# Altium schematic sheet ANALOG_VOUTPUT.SchDoc
size A4; SheetNumber: 9; SheetTotal: 17
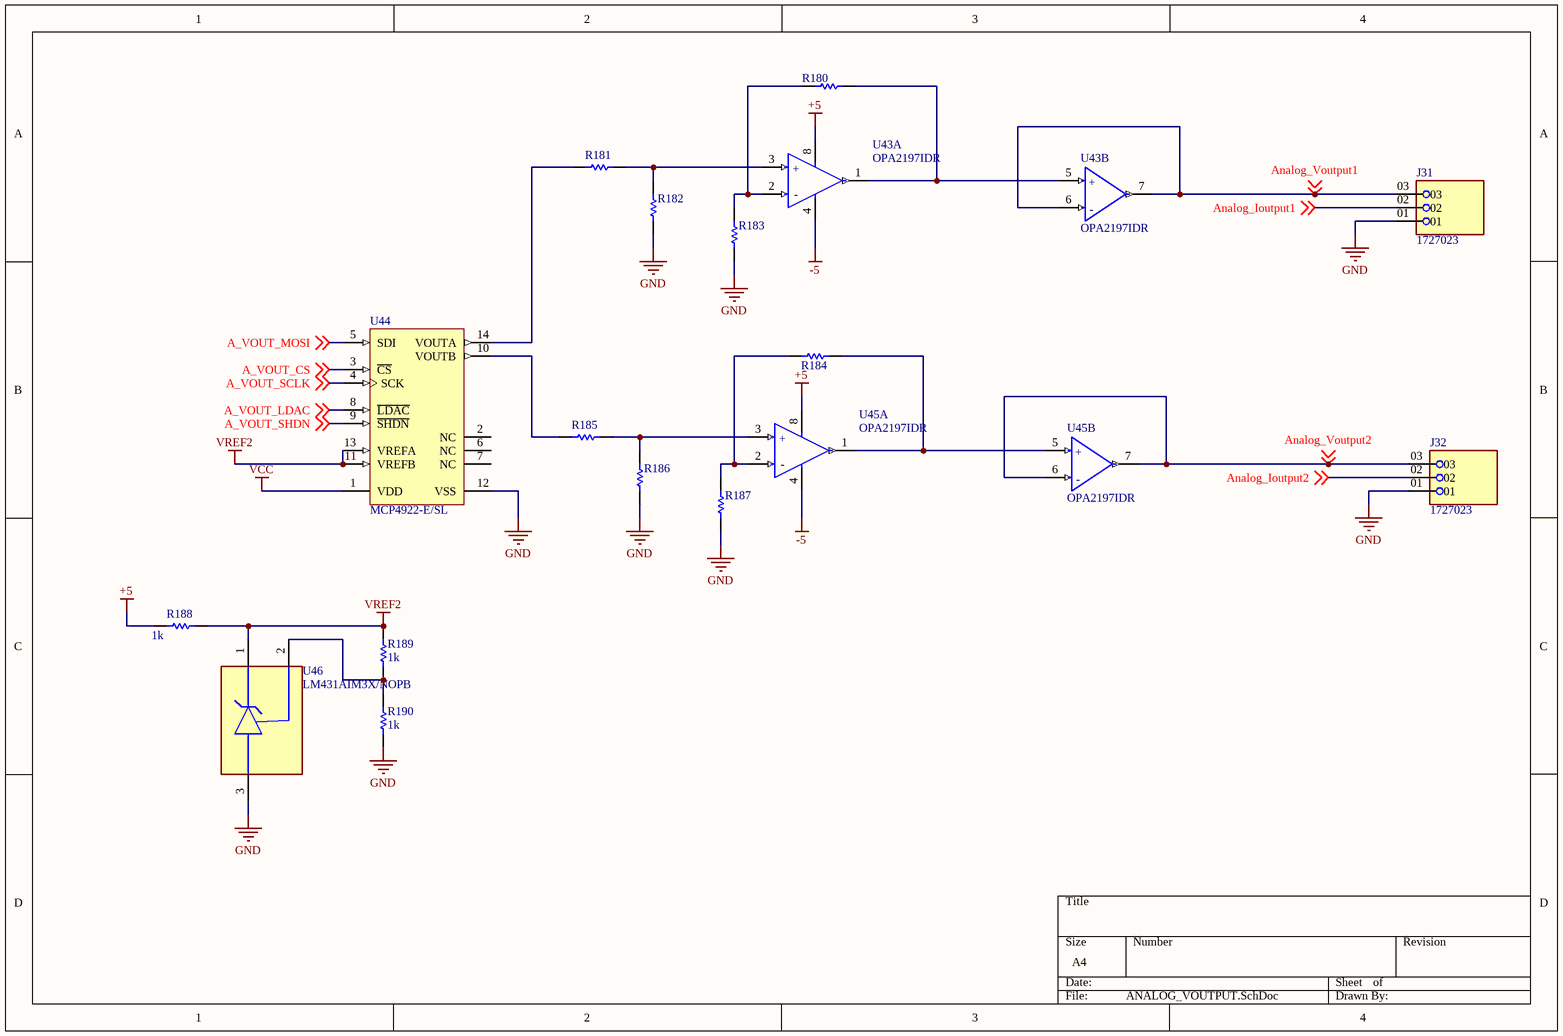
[diagram p0: ANALOG_VOUTPUT.SchDoc]

## Parts
J31  1727023  [PHOENIX_1727023]
J32  1727023  [PHOENIX_1727023]
R180  CRCW060310K0FKEA  [RESC1609X50X30NL8T20]  (value not drawn)
R181  CRCW060310K0FKEA  [RESC1609X50X30NL8T20]  (value not drawn)
R182  CRCW060310K0FKEA  [RESC1609X50X30NL8T20]  (value not drawn)
R183  CRCW060310K0FKEA  [RESC1609X50X30NL8T20]  (value not drawn)
R184  CRCW060310K0FKEA  [RESC1609X50X30NL8T20]  (value not drawn)
R185  CRCW060310K0FKEA  [RESC1609X50X30NL8T20]  (value not drawn)
R186  CRCW060310K0FKEA  [RESC1609X50X30NL8T20]  (value not drawn)
R187  CRCW060310K0FKEA  [RESC1609X50X30NL8T20]  (value not drawn)
R188  value 1k  [RESC2013X50X30NL20T20]  (hidden comment: CRCW08051K00FKTC)
R189  value 1k  [RESC2013X50X30NL20T20]  (hidden comment: CRCW08051K00FKTC)
R190  value 1k  [RESC2013X50X30NL20T20]  (hidden comment: CRCW08051K00FKTC)
U43  OPA2197IDR  [FP-D0008A-MFG]  (parts A,B of 2)
U44  MCP4922-E/SL  [SOIC-SL14_M]
U45  OPA2197IDR  [FP-D0008A-MFG]  (parts A,B of 2)
U46  LM431AIM3X/NOPB  [FP-DBZ0003A-IPC_B]

## Nets
+5: R188.1 U43.8(V+) U45.8(V+)
-5: U43.4(V-) U45.4(V-)
GND: J31.01 J32.01 R182.1 R183.1 R186.1 R187.1 R190.1 U44.12(VSS) U46.3(A)
VCC: U44.1(VDD)
VREF2: R188.2 R189.2 U44.11(VREFB) U44.13(VREFA) U46.1(C)
A_VOUT_CS: U44.3(~{CS}) ; off-sheet A_VOUT_CS
A_VOUT_LDAC: U44.8(~{LDAC}) ; off-sheet A_VOUT_LDAC
A_VOUT_MOSI: U44.5(SDI) ; off-sheet A_VOUT_MOSI
A_VOUT_SCLK: U44.4(SCK) ; off-sheet A_VOUT_SCLK
A_VOUT_SHDN: U44.9(~{SHDN}) ; off-sheet A_VOUT_SHDN
Analog_Ioutput1: J31.02 ; off-sheet Analog_Ioutput1
Analog_Ioutput2: J32.02 ; off-sheet Analog_Ioutput2
Analog_Voutput1: J31.03 U43.6(-IN_B) U43.7(OUT_B) ; off-sheet Analog_Voutput1
Analog_Voutput2: J32.03 U45.6(-IN_B) U45.7(OUT_B) ; off-sheet Analog_Voutput2
NetR180_1: R180.1 U43.1(OUT_A) U43.5(+IN_B)
NetR180_2: R180.2 R183.2 U43.2(-IN_A)
NetR181_1: R181.1 U44.14(VOUTA)
NetR181_2: R181.2 R182.2 U43.3(+IN_A)
NetR184_1: R184.1 U45.1(OUT_A) U45.5(+IN_B)
NetR184_2: R184.2 R187.2 U45.2(-IN_A)
NetR185_1: R185.1 U44.10(VOUTB)
NetR185_2: R185.2 R186.2 U45.3(+IN_A)
NetR189_1: R189.1 R190.2 U46.2(REF)

Not connected (* = marked no-connect by the designer): U44 2(NC) 6(NC) 7(NC)

## Notes on the sheet
- (in symbol CMP-04895-000044-1, part A) +; -
- (in symbol CMP-04895-000044-1, part B) +; -

## Library data of the parts
J31 J32 = 1727023: PCB Terminal Screw 3.81mm 16AWG 200V 13.5A 3 Position COMBICON MKDS Series | Phoenix Contact 1727023; SnapEDA_Link: https://www.snapeda.com/parts/1727023/Phoenix+Contact/view-part/?ref=snap; Package: None; Value: *; MF: Phoenix Contact; MP: 1727023; Check_prices: https://www.snapeda.com/parts/1727023/Phoenix+Contact/view-part/?ref=eda
R180-R187 = CMP-1666-00005-4: Chip Resistor, 10 KOhm, +/- 1%, 100 mW, -55 to 155 degC, 0603 (1608 Metric), RoHS, Tape and Reel; Manufacturer: Vishay Semiconductor; Voltage Rating: 75 V; Max Operating Temperature: 155 degC; PackageDescription: 2-Pin Surface Mount Device, Body 1.575 x 0.85 mm; ComponentLink1Description: Manufacturer URL; RoHSCompliant: true; PackageReference: 0603; REACH SVHC: Unknown; Length: 1.55 mm; DatasheetVersion: 06/2012; Packaging: Tape and Reel; Min Operating Temperature: -55 degC; Mounting Technology: Surface Mount; ComponentLink2URL: https://datasheet.ciiva.com/11809/0900766b80d98afc-11809037.pdf; Height: 0.45 mm; ComponentLink2Description: Datasheet; Package Quantity: 5000; ComponentLink1URL: http://www.vishay.com/
R188-R190 = CMP-2001-04268-1: Manufacturer: Vishay Dale; Part Number: CRCW08051K00FKTC
U43 U45 = CMP-04895-000044-1: IC OP AMP GP RR 10MHZ 8-SOIC; Manufacturer: Texas Instruments; Output Current Per Channel: 65mA; Min Supply Voltage: 4.5V; Input Offset Voltage: 0.025mV; Number Of Channels: 2; Voltage Gain: 134-143dB; Max Dual Supply Voltage: 18V; Min Dual Supply Voltage: 2.25V; Standoff Height: 0.11mm; Max Supply Voltage: 36V; Input Bias Current: 0.000005uA; Nominal Supply Current: 1mA; Max Junction Temp: +150°C; Temperature Range Low: -40°C; Package: D0008A; Temperature: -40°C to +125°C; Gain Bandwidth: 10MHz; Category: IC; Digikey Description: IC OP AMP GP RR 10MHZ 8-SOIC; Automotive: No; Height: 1.75mm; Ambient Temperature Range Low: -40°C; Device Class L3: Amplifiers - Op Amps; ComponentLink2URL: http://www.ti.com/lit/ds/symlink/opa2197.pdf; Lead Free: Yes; RoHS: TRUE; Manufacturer Part Number: OPA2197IDR; Device Class L1: Integrated Circuits (ICs); ComponentLink2Description: Datasheet; Ipc Land Pattern Name: SOIC127P600X175-8; Device Class L2: Linear ICs; Temperature Range High: +125°C; Octopart: https://octopart.com/opa2197idr-texas+instruments-75179702; Ambient Temperature Range High: +125°C
U44 = CMP-0188-00496-2: 12-Bit DAC with SPI Interface, 14-Pin SOIC 150mil, Extended Temperature; ComponentLink2Description: Datasheet; DatasheetVersion: revA, Apr-2010; RevisionNote: URLs added. DatasheetVersion updated. Sch updated.; Code_IPC: SOIC127P600-14; PackageVersion: revBB, Aug-2009; PackageReference: SOIC-SL14; ComponentLink3URL: http://www.microchip.com/stellent/groups/techpub_sg/documents/packagingspec/en012702.pdf; ComponentLink3Description: Package Specification; ComponentLink2URL: http://ww1.microchip.com/downloads/en/DeviceDoc/22250A.pdf; ComponentLink1URL: http://www.microchip.com/; Code_JEDEC: MS-012-AB; PackageDescription: 14-Lead Plastic Small Outline (SL) - Narrow, 3.90mm Body [SOIC]; ComponentLink1Description: Manufacturer URL
U46 = CMP-04916-000022-1: IC VREF SHUNT 37V 2.2% SOT23-3; Temperature Coefficient: 50ppm/°C; Tolerance: 2%; Max Output Current: 100mA; Cathode Current: 1mA; Number of Channels: 1; Radiation Hardening: No; Packaging: Tape and Reel; Package Quantity: 3000; Max Output Voltage: 37V; Max Input Voltage: 37V; Min Operating Temperature: -40°C; Case/Package: SOT-23; Lead Free: Lead Free; Number of Pins: 3; Output Current: 100mA; RoHS Compliant: Yes; Max Operating Temperature: 85°C; Reference Type: Shunt; Output Voltage: 37V; Mount: Surface Mount